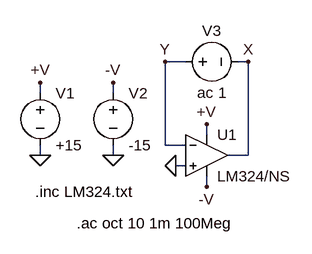
[diagram p0: schematic include.asc]
include.asc, the LTspice schematic file:
Version 4
SHEET 1 880 680
WIRE 144 112 112 112
WIRE 240 112 224 112
WIRE -80 160 -80 144
WIRE 32 160 32 144
WIRE 176 224 176 208
WIRE 112 240 112 112
WIRE 144 240 112 240
WIRE -80 256 -80 240
WIRE 32 256 32 240
WIRE 240 256 240 112
WIRE 240 256 208 256
WIRE 144 272 128 272
WIRE 176 304 176 288
FLAG 176 208 +V
FLAG 176 304 -V
FLAG 32 256 0
FLAG -80 256 0
FLAG -80 144 +V
FLAG 32 144 -V
FLAG 128 272 0
FLAG 240 112 X
FLAG 112 112 Y
SYMBOL opamps\\opamp2 176 192 R0
SYMATTR InstName U1
SYMATTR Value LM324/NS
SYMBOL voltage -80 144 R0
SYMATTR InstName V1
SYMATTR Value +15
SYMBOL voltage 32 144 R0
SYMATTR InstName V2
SYMATTR Value -15
SYMBOL voltage 128 112 R270
WINDOW 0 32 56 VTop 0
WINDOW 3 -32 56 VBottom 0
SYMATTR InstName V3
SYMATTR Value ac 1
TEXT -88 312 Left 0 !.inc LM324.txt
TEXT -24 360 Left 0 !.ac oct 10 1m 100Meg

The netlist it stands for:
* include.asc
XU1 0 Y +V -V X LM324/NS  ; pins In+ In- V+ V- OUT
V1 +V 0 +15
V2 -V 0 -15
V3 Y X ac 1
.inc LM324.txt
.ac oct 10 1m 100Meg
.backanno
.end